# EAGLE design shinobi_BLE_analog (EAGLE 8.5.1)
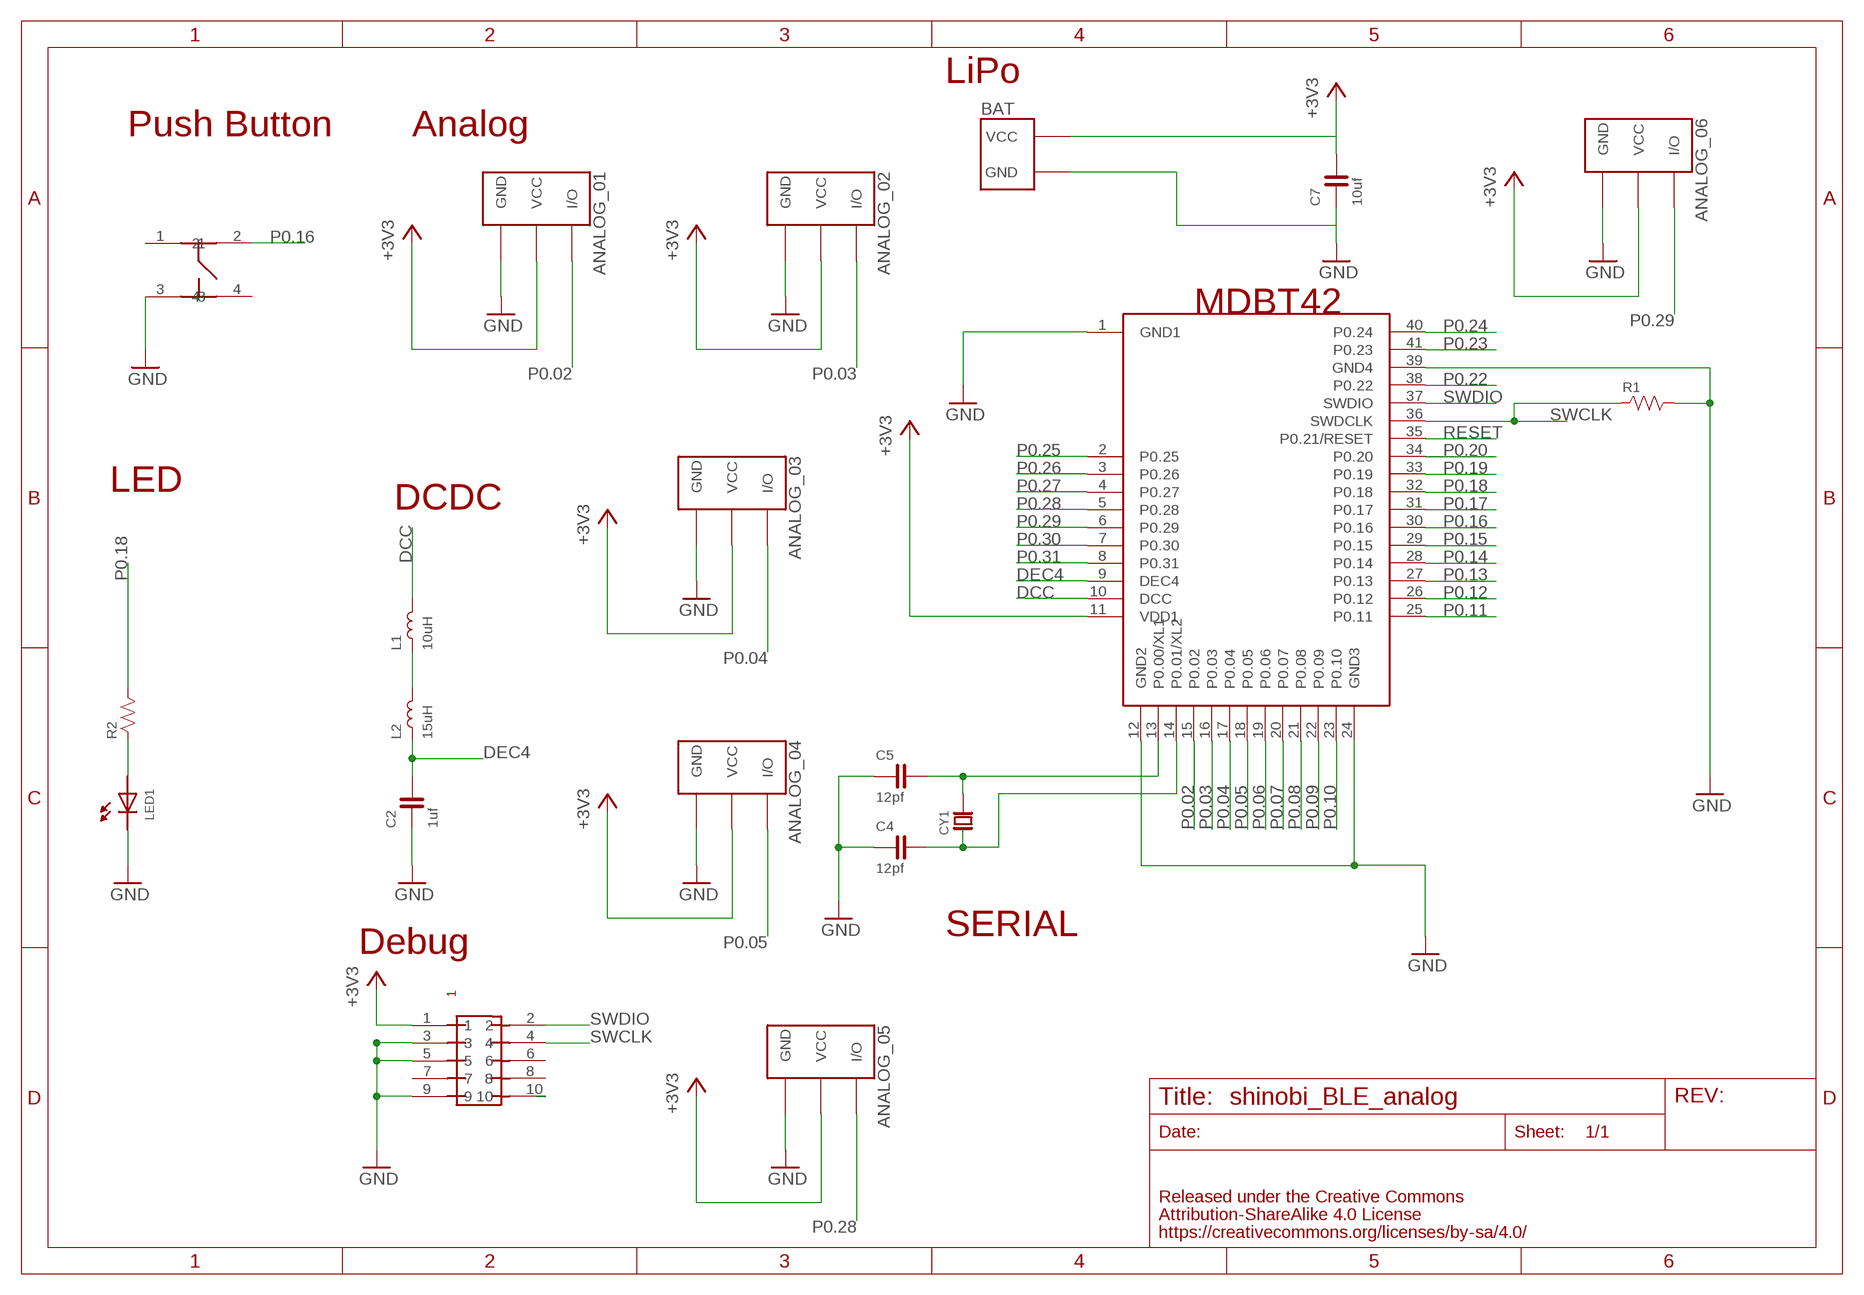
[diagram p0: schematic, sheet 1]

## Parts
ANALOG_01  FABO_BRICK_3PIN-S03B-PASK-2_LONG  [FABO_BRICK_3PIN_S03B-PASK-2_LONG]
ANALOG_02  FABO_BRICK_3PIN-S03B-PASK-2_LONG  [FABO_BRICK_3PIN_S03B-PASK-2_LONG]
ANALOG_03  FABO_BRICK_3PIN-S03B-PASK-2_LONG  [FABO_BRICK_3PIN_S03B-PASK-2_LONG]
ANALOG_04  FABO_BRICK_3PIN-S03B-PASK-2_LONG  [FABO_BRICK_3PIN_S03B-PASK-2_LONG]
ANALOG_05  FABO_BRICK_3PIN-S03B-PASK-2_LONG  [FABO_BRICK_3PIN_S03B-PASK-2_LONG]
ANALOG_06  FABO_BRICK_3PIN-S03B-PASK-2_LONG  [FABO_BRICK_3PIN_S03B-PASK-2_LONG]
BAT  FABO_BRICK_2PIN_SIDE  [FABO_BRICK_2PIN_S02B−PASK-2_SILK]
C2  1uf  CAPACITOR-0603  [0603]
C4  12pf  CAPACITOR-0603  [0603]
C5  12pf  CAPACITOR-0603  [0603]
C7  10uf  CAPACITOR-0603  [0603]
CY1  CRYSTAL-ABS07  [ABRACON-ABS07-32.768KHZ]
L1  10uH  INDUCTOR-0603  [0603]
L2  15uH  INDUCTOR-1812  [1812]
LED1  LED-0603  [0603]
R1  RESISTOR-0603  [0603]
R2  RESISTOR-0603  [0603]
U$2  RAYTAC-MDBT42  [RAYTAC-MDBT42]
U$4  PIN-HEADER-SMT(1.27MM)2X5  [PIN-HEADER-SMT(1.27MM)2X5]
U$5  SWICTH-4P(KMR2)  [SWITCH-4P(KMR2)]

## Nets
+3V3: ANALOG_01.VCC ANALOG_02.VCC ANALOG_03.VCC ANALOG_04.VCC ANALOG_05.VCC ANALOG_06.VCC BAT.VCC C7.2 U$2.11(VDD1) U$4.1
DCC: L1.2 U$2.10(DCC)
DEC4: C2.2 L2.P$1 U$2.9(DEC4)
GND: ANALOG_01.GND ANALOG_02.GND ANALOG_03.GND ANALOG_04.GND ANALOG_05.GND ANALOG_06.GND BAT.GND C2.1 C4.1 C5.1 C7.1 LED1.CATHODE R1.2 U$2.1(GND1) U$2.12(GND2) U$2.24(GND3) U$2.39(GND4) U$4.3 U$4.5 U$4.9 U$5.3
N$1: LED1.ANODE R2.1
N$2: L1.1 L2.P$2
N$7: C5.2 CY1.P$2 U$2.13(P0.00/XL1)
N$8: C4.2 CY1.P$1 U$2.14(P0.01/XL2)
P0.02: ANALOG_01.I/O U$2.15(P0.02)
P0.03: ANALOG_02.I/O U$2.16(P0.03)
P0.04: ANALOG_03.I/O U$2.17(P0.04)
P0.05: ANALOG_04.I/O U$2.18(P0.05)
P0.06: U$2.19(P0.06)
P0.07: U$2.20(P0.07)
P0.08: U$2.21(P0.08)
P0.09: U$2.22(P0.09)
P0.10: U$2.23(P0.10)
P0.11: U$2.25(P0.11)
P0.12: U$2.26(P0.12)
P0.13: U$2.27(P0.13)
P0.14: U$2.28(P0.14)
P0.15: U$2.29(P0.15)
P0.16: U$2.30(P0.16) U$5.2
P0.17: U$2.31(P0.17)
P0.18: R2.2 U$2.32(P0.18)
P0.19: U$2.33(P0.19)
P0.20: U$2.34(P0.20)
P0.22: U$2.38(P0.22)
P0.23: U$2.41(P0.23)
P0.24: U$2.40(P0.24)
P0.25: U$2.2(P0.25)
P0.26: U$2.3(P0.26)
P0.27: U$2.4(P0.27)
P0.28: ANALOG_05.I/O U$2.5(P0.28)
P0.29: ANALOG_06.I/O U$2.6(P0.29)
P0.30: U$2.7(P0.30)
P0.31: U$2.8(P0.31)
RESET: U$2.35(P0.21/RESET)
RESET1: U$4.10
SWCLK: R1.1 U$2.36(SWDCLK) U$4.4
SWDIO: U$2.37(SWDIO) U$4.2
Unconnected: U$4.6 U$4.7 U$4.8 U$5.1 U$5.4

## Notes on the sheet
- LiPo
- Push Button | Analog
- MDBT42
- LED
- DCDC
- SERIAL
- Debug

## Library data of the parts
ANALOG_01-ANALOG_06 = FaBo-Template:FABO_BRICK_3PIN: FaBo Brick 3pin
BAT = FaBo-Template:FABO_BRICK_2PIN
C2 C4 C5 C7 = FaBo-Capacitor:CAPACITOR: CAPACITOR
CY1 = FaBo-Crystal:CRYSTAL
L1 L2 = FaBo-Inductor:INDUCTOR: RESISTOR
LED1 = FaBo-LED:LED
R1 R2 = FaBo-Resistors:RESISTOR: RESISTOR
U$2 = FaBo-BT:RAYTAC-MDBT42
U$4 = gclue:PIN-HEADER-SMT(1.27MM)2X5: PIN-HEADER-SMT (1.27MM) 2x5
U$5 = gclue-test:SWICTH-4P(KMR2)

## Board
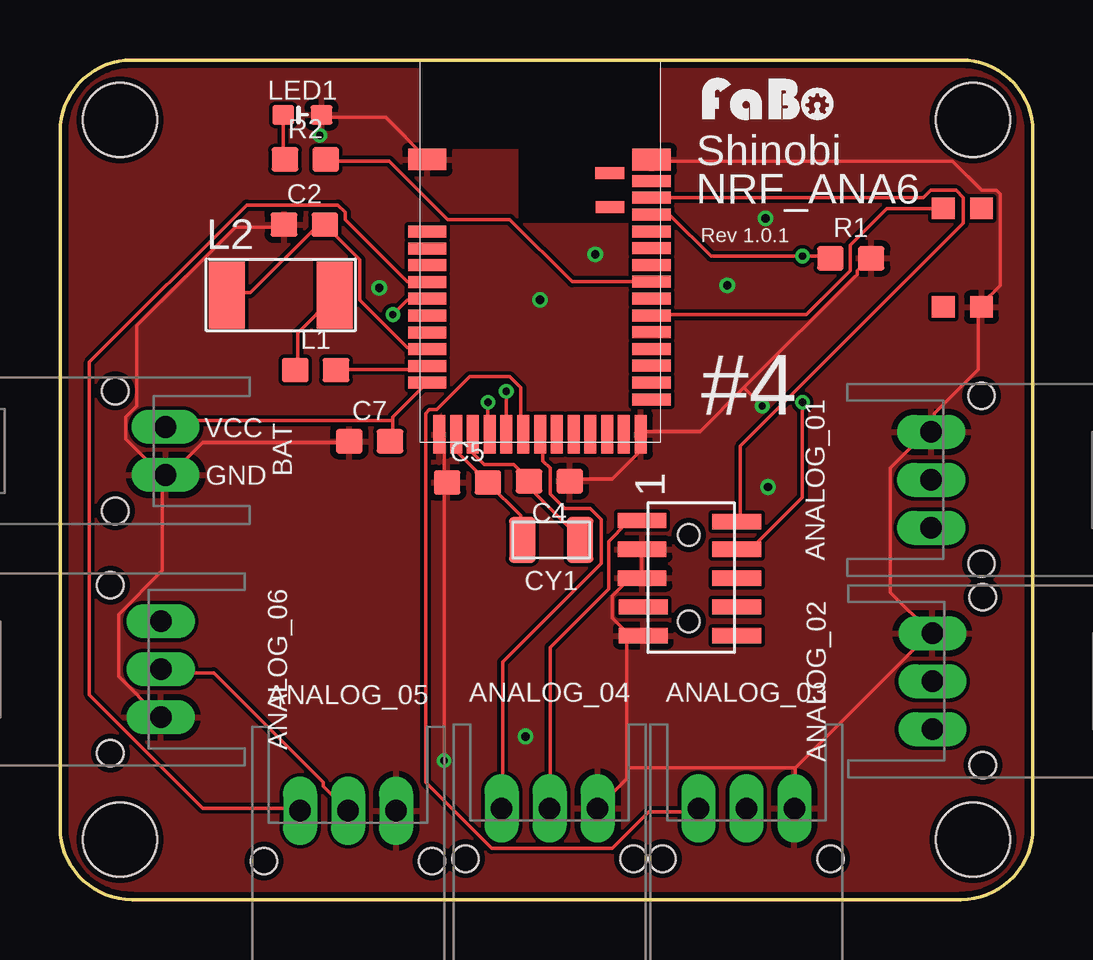
[diagram p1: board, top side]
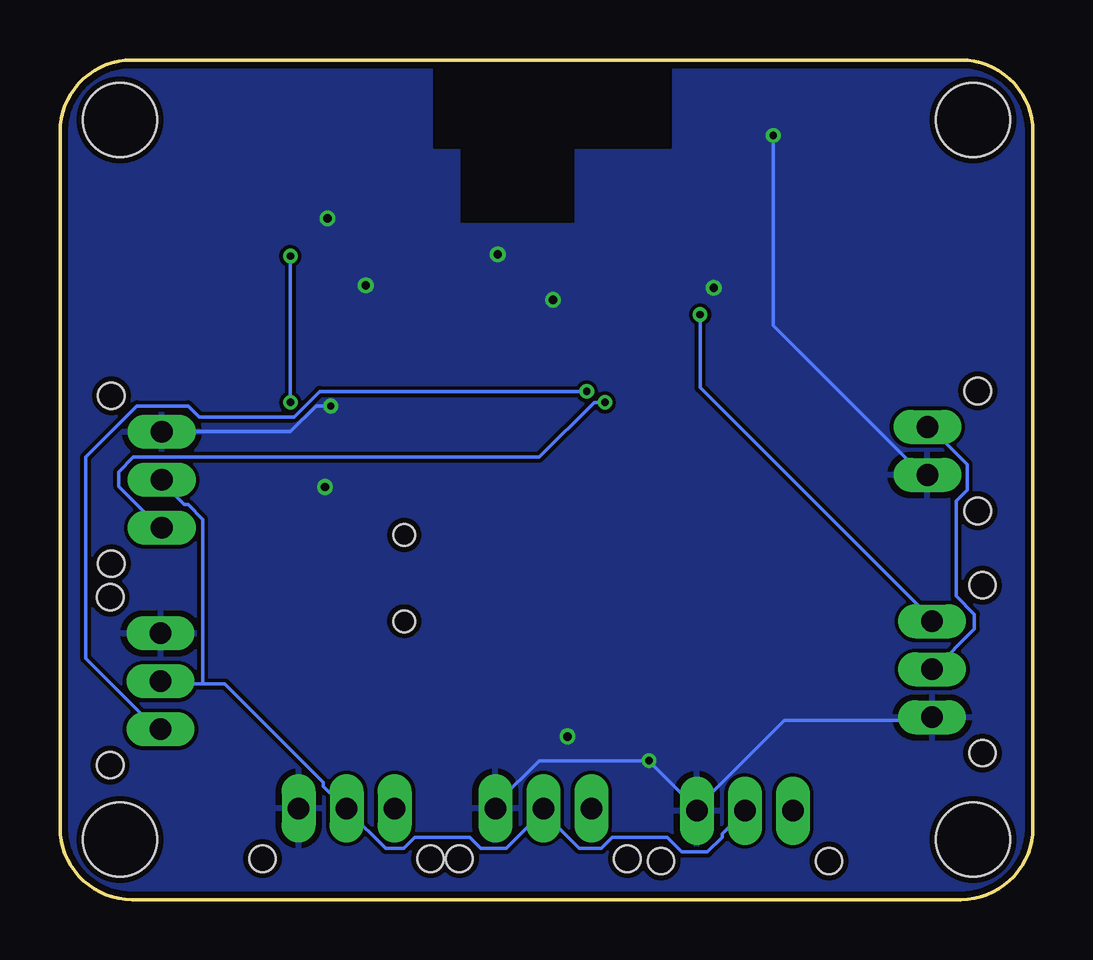
[diagram p2: board, bottom side, seen from below]

Size 40.54 x 35 mm. Coordinates in mm from the lower left corner, seen from the top.
Copper layers (1*16): Top 0.035mm / dielectric 1.5mm / Bottom 0.035mm
Design rules "SeeedStudio_2layer_DRU_no_angle_20140221": minimum track width 6mil, minimum drill 12mil, track to track 6mil, track to pad 6mil, pad to pad 6mil, via to via 6mil, smd to smd 0mil, copper to edge 10mil, drill to drill 10mil, minimum pad ring 10mil, minimum via ring 6mil, stop-mask expansion 2mil, vias tented up to drill 100mil, thermal gap 10mil

### Footprints (pad centres in the part's own frame; a part is rotated, then mirrored left to right if it is on the bottom)
FABO_BRICK_3PIN_S03B-PASK-2_LONG = drill 0.9 pad 1.422 long: GND -2,0; I/O 2,0; VCC 0,0 | hole 1.1: 3.5,2.1; -3.5,2.1
FABO_BRICK_2PIN_S02B−PASK-2_SILK = drill 0.9 pad 1.422 long: GND -1,-0.102; VCC 1,-0.102 | hole 1.1: 2.5,1.998; -2.5,1.998
0603 = smd 1.1 x 1: 1 -0.85,0; 2 0.85,0
ABRACON-ABS07-32.768KHZ = smd 1.1 x 1.9: P$1 -1.2,0; P$2 1.2,0
1812 = smd 1.5 x 2.8: P$1 -2.25,0; P$2 2.25,0
0603' = smd 0.9 x 0.8: ANODE -0.8,0; CATHODE 0.8,0
FABO-SHINOBI = hole 3.1: 2.5,32.5; 38.04,32.5; 38.04,2.5; 2.5,2.5
RAYTAC-MDBT42 = smd 1.6 x 0.9: 1 -4.7,3.8; 39 4.65,3.79 | smd 1.6 x 0.5: 2 -4.7,0.79; 3 -4.7,0.09; 4 -4.7,-0.61; 5 -4.7,-1.31; 6 -4.7,-2.01; 7 -4.7,-2.71; 8 -4.7,-3.41; 9 -4.7,-4.11; 10 -4.7,-4.81; 11 -4.7,-5.51; 25 4.65,-6.2; 26 4.65,-5.5; 27 4.65,-4.8; 28 4.65,-4.1; 29 4.65,-3.4; 30 4.65,-2.7; 31 4.65,-2; 32 4.65,-1.3; 33 4.65,-0.6; 34 4.65,0.1; 35 4.65,0.8; 36 4.65,1.5; 37 4.65,2.2; 38 4.65,2.9 | smd 0.5 x 1.6: 12 -4.2,-7.66; 13 -3.5,-7.66; 14 -2.8,-7.66; 15 -2.1,-7.66; 16 -1.4,-7.66; 17 -0.7,-7.66; 18 0,-7.66; 19 0.7,-7.66; 20 1.4,-7.66; 21 2.1,-7.66; 22 2.8,-7.66; 23 3.48,-7.66; 24 4.2,-7.66 | smd 1.2 x 0.5: 40 2.91,3.23; 41 2.92,1.81
PIN-HEADER-SMT(1.27MM)2X5 = smd 0.635 x 2.032: 1 -2.4,-1.95; 2 -2.35,2; 3 -1.2,-1.95; 4 -1.2,2; 5 0,-1.95; 6 0,2; 7 1.2,-1.9; 8 1.2,2; 9 2.4,-1.9; 10 2.4,2 | hole 0.9: 1.8,0; -1.8,0
SWITCH-4P(KMR2) = smd 0.9 x 0.95: 1 -1,0; 2 3.1,0; 3 -1,-1.6; 4 3.1,-1.6

### Placement (x,y rotation side)
ANALOG_01  36.3,17.5 270 top
ANALOG_02  36.35,9.1 270 top
ANALOG_03  28.6,3.8 180 top
ANALOG_04  20.4,3.8 180 top
ANALOG_05  12,3.7 180 top
ANALOG_06  4.2,9.6 90 top
BAT  4.3,18.7 90 top
C2  10.18,28.14 0 top
C4  20.39,17.44 180 top
C5  16.98,17.39 0 top
C7  12.9,19.1 0 top
CY1  20.47,14.99 180 top
L1  10.65,22.07 0 top
L2  9.2,25.2 0 top
LED1  [0603']  10.1,32.71 0 top
R1  32.95,26.73 0 top
R2  10.22,30.85 0 top
U$1  [FABO-SHINOBI]  0,0 0 top
U$2  20,27.05 0 top
U$3  [LOGO_FABO_S]  29.55,32.35 0 top
U$4  26.2,13.4 270 top
U$5  36.8,25.71 90 top

### Tracks (layer width: path | path; a pad name or v marks a point on that pad's centre or on a via)
+3V3
  Top 0.152: 13.87,19.96 13.87,20.12 15.24,21.49 U$2.11 | 13.87,19.96 13.87,19.2 C7.2 | 13.87,19.96 4.57,19.96 4.42,19.81 BAT.VCC | ANALOG_05.VCC 11.89,3.81 10.97,4.72 10.97,4.88 6.4,9.45 4.27,9.45 ANALOG_06.VCC | U$4.1 24.23,15.7 23.62,15.7 22.86,14.94 22.86,12.95 20.42,10.52 20.42,3.81 ANALOG_04.VCC
  Bottom 0.152: BAT.VCC 4.27,19.66 2.74,18.14 2.74,17.07 3.2,16.61 3.2,12.65 2.44,11.89 2.44,11.28 4.12,9.6 ANALOG_06.VCC | 34.59,8.99 36.27,8.99 ANALOG_02.VCC | 34.59,8.99 33.68,8.99 29.57,4.88 29.57,4.72 28.65,3.81 ANALOG_03.VCC 28.5,3.66 26.98,2.13 26.21,2.13 25.76,2.59 23.47,2.59 23.01,2.13 21.95,2.13 20.42,3.66 | 34.59,8.99 34.59,15.85 35.2,16.46 35.36,16.46 36.27,17.37 ANALOG_01.VCC | 20.42,3.66 18.9,2.13 17.98,2.13 17.53,2.59 15.24,2.59 14.63,1.98 13.56,1.98 12.95,2.59 12.95,2.74 12.04,3.66 ANALOG_05.VCC | 20.42,3.66 ANALOG_04.VCC
DCC
  Top 0.152: L1.2 11.58,22.1 15.24,22.1 U$2.10
DEC4
  Top 0.152: L2.P$1 7.01,25.3 7.92,25.3 10.67,28.04 10.97,28.04 C2.2 11.12,28.04 12.5,26.67 12.5,24.99 14.48,23.01 15.24,23.01 U$2.9
GND  (via drill 0.3, 0.35)
  Top 0.152: C4.1 21.34,17.53 23.01,17.53 24.08,18.59 24.08,19.36 U$2.24 24.23,19.51 26.67,19.51 28.5,21.34 | 28.5,21.34 33.22,26.06 33.22,26.21 33.68,26.67 R1.2 | U$2.39 24.69,30.79 37.19,30.79 38.41,29.57 39.01,29.57 39.17,29.41 39.17,25.6 38.41,24.84 U$5.3 38.25,24.69 38.25,22.1 36.42,20.27 36.42,19.51 ANALOG_01.GND 36.27,19.36 35.97,19.36 34.59,17.98 34.59,12.8 36.27,11.12 | v29.26,20.57 28.5,21.34 | U$2.1 15.24,30.94 13.56,32.61 10.97,32.61 LED1.CATHODE 10.82,32.61 v10.82,31.85 | C7.1 12.04,19.05 5.94,19.05 4.72,17.83 4.42,17.83 BAT.GND 4.27,17.68 | 4.27,17.68 2.74,19.2 2.74,20.12 3.2,20.57 3.2,23.93 7.32,28.04 9.3,28.04 C2.1 | 30.63,5.49 30.63,3.81 ANALOG_03.GND | 36.27,11.12 30.63,5.49 | U$4.3 24.23,14.48 24.23,13.41 U$4.5 24.23,13.26 23.62,13.26 23.01,12.65 23.01,11.73 23.62,11.12 | 23.62,11.12 24.23,11.12 U$4.9 23.62,11.12 | U$2.12 15.85,19.36 16,19.2 16,17.53 C5.1 16,17.37 v16,5.79 | 23.62,5.49 23.62,5.03 ANALOG_04.GND | 23.62,5.49 23.62,11.12 | 23.62,5.49 30.63,5.49 | 4.27,17.68 4.27,13.72 2.44,11.89 2.44,9.3 4.12,7.62 ANALOG_06.GND | 36.27,11.12 ANALOG_02.GND
  Bottom 0.152: v29.26,20.57 29.87,20.57 30.94,19.51 36.27,19.51 ANALOG_01.GND | v10.82,31.85 10.82,23.93 4.72,17.83 4.42,17.83 BAT.GND | 14.02,3.81 v16,5.79 20.57,5.79 22.25,4.12 22.25,3.81 ANALOG_04.GND | 14.02,3.81 10.36,7.47 4.27,7.47 ANALOG_06.GND | 14.02,3.81 ANALOG_05.GND
  other vias: 20,25 27.8,25.6 22.3,26.9 29.4,28.4 29.5,17.2 13.3,25.5 19.4,6.8
  pour Bottom: 0,0 0,35 41,35 41,0
  pour Top: 0,0 0,35 41,35 41,0
N$1
  Top 0.152: LED1.ANODE 9.3,32.61 9.3,30.94 R2.1
N$2
  Top 0.152: L1.1 9.91,22.1 9.91,23.62 11.43,25.15 L2.P$2
N$7
  Top 0.152: U$2.13 16.61,19.36 16.61,18.59 17.68,17.53 C5.2 17.83,17.37 19.2,16 19.2,15.09 CY1.P$2
N$8
  Top 0.152: CY1.P$1 21.64,15.09 19.66,17.07 19.66,17.37 C4.2 19.51,17.53 18.9,18.14 17.68,18.14 17.22,18.59 17.22,19.36 U$2.14
P0.02  (via drill 0.3)
  Top 0.152: v17.83,20.73 17.83,19.51 U$2.15
  Bottom 0.152: v17.83,20.73 18.29,20.73 20.57,18.44 37.49,18.44 38.1,17.83 38.1,17.22 36.42,15.54 ANALOG_01.I/O
P0.03  (via drill 0.3)
  Top 0.152: v18.59,21.18 18.59,19.51 U$2.16
  Bottom 0.152: v18.59,21.18 29.72,21.18 30.79,20.12 34.75,20.12 35.2,20.57 37.34,20.57 39.47,18.44 39.47,10.06 36.42,7.01 ANALOG_02.I/O
P0.04
  Top 0.152: U$2.17 19.2,19.51 19.2,21.34 18.75,21.79 17.07,21.79 15.7,20.42 15.39,20.42 15.24,20.27 15.24,4.88 17.98,2.13 23.01,2.13 24.54,3.66 26.52,3.66 ANALOG_03.I/O
P0.05
  Top 0.152: U$2.18 20.12,19.36 20.12,18.29 20.42,17.98 20.42,16.92 21.03,16.31 22.1,16.31 22.55,15.85 22.55,14.02 18.44,9.91 18.44,3.81 ANALOG_04.I/O
P0.16
  Top 0.152: U$5.2 36.73,28.8 34.44,28.8 32.92,27.28 32.92,26.21 31.09,24.38 24.69,24.38 U$2.30
P0.18
  Top 0.152: R2.2 11.12,30.79 13.72,30.79 16.15,28.35 18.75,28.35 21.34,25.76 24.54,25.76 U$2.32
P0.28
  Top 0.152: U$2.5 15.24,25.76 14.48,25.76 11.89,28.35 11.89,28.65 11.58,28.96 7.77,28.96 1.22,22.4 1.22,8.53 5.94,3.81 9.91,3.81 ANALOG_05.I/O
P0.29  (via drill 0.3)
  Top 0.152: v13.87,24.38 14.48,24.99 15.24,24.99 U$2.6
  Bottom 0.152: v13.87,24.38 13.87,21.34 4.27,11.73 ANALOG_06.I/O
SWCLK  (via drill 0.3)
  Top 0.152: R1.1 32,26.82 v30.94,26.82 27.13,26.82 25.45,28.5 24.69,28.5 U$2.36 | v30.94,20.73 30.94,16.76 28.8,14.63 28.35,14.63 U$4.4
  Bottom 0.152: v30.94,26.82 v30.94,20.73
SWDIO
  Top 0.152: U$2.37 24.69,29.26 35.97,29.26 36.27,29.57 37.34,29.57 37.64,29.26 37.64,28.19 28.35,18.9 28.35,15.85 U$4.2

### Text on the board
tPlace: Shinobi | NRF_ANA6 | Rev 1.0.1 | #4